# Altium schematic sheet ShieldUart.SchDoc
size A4
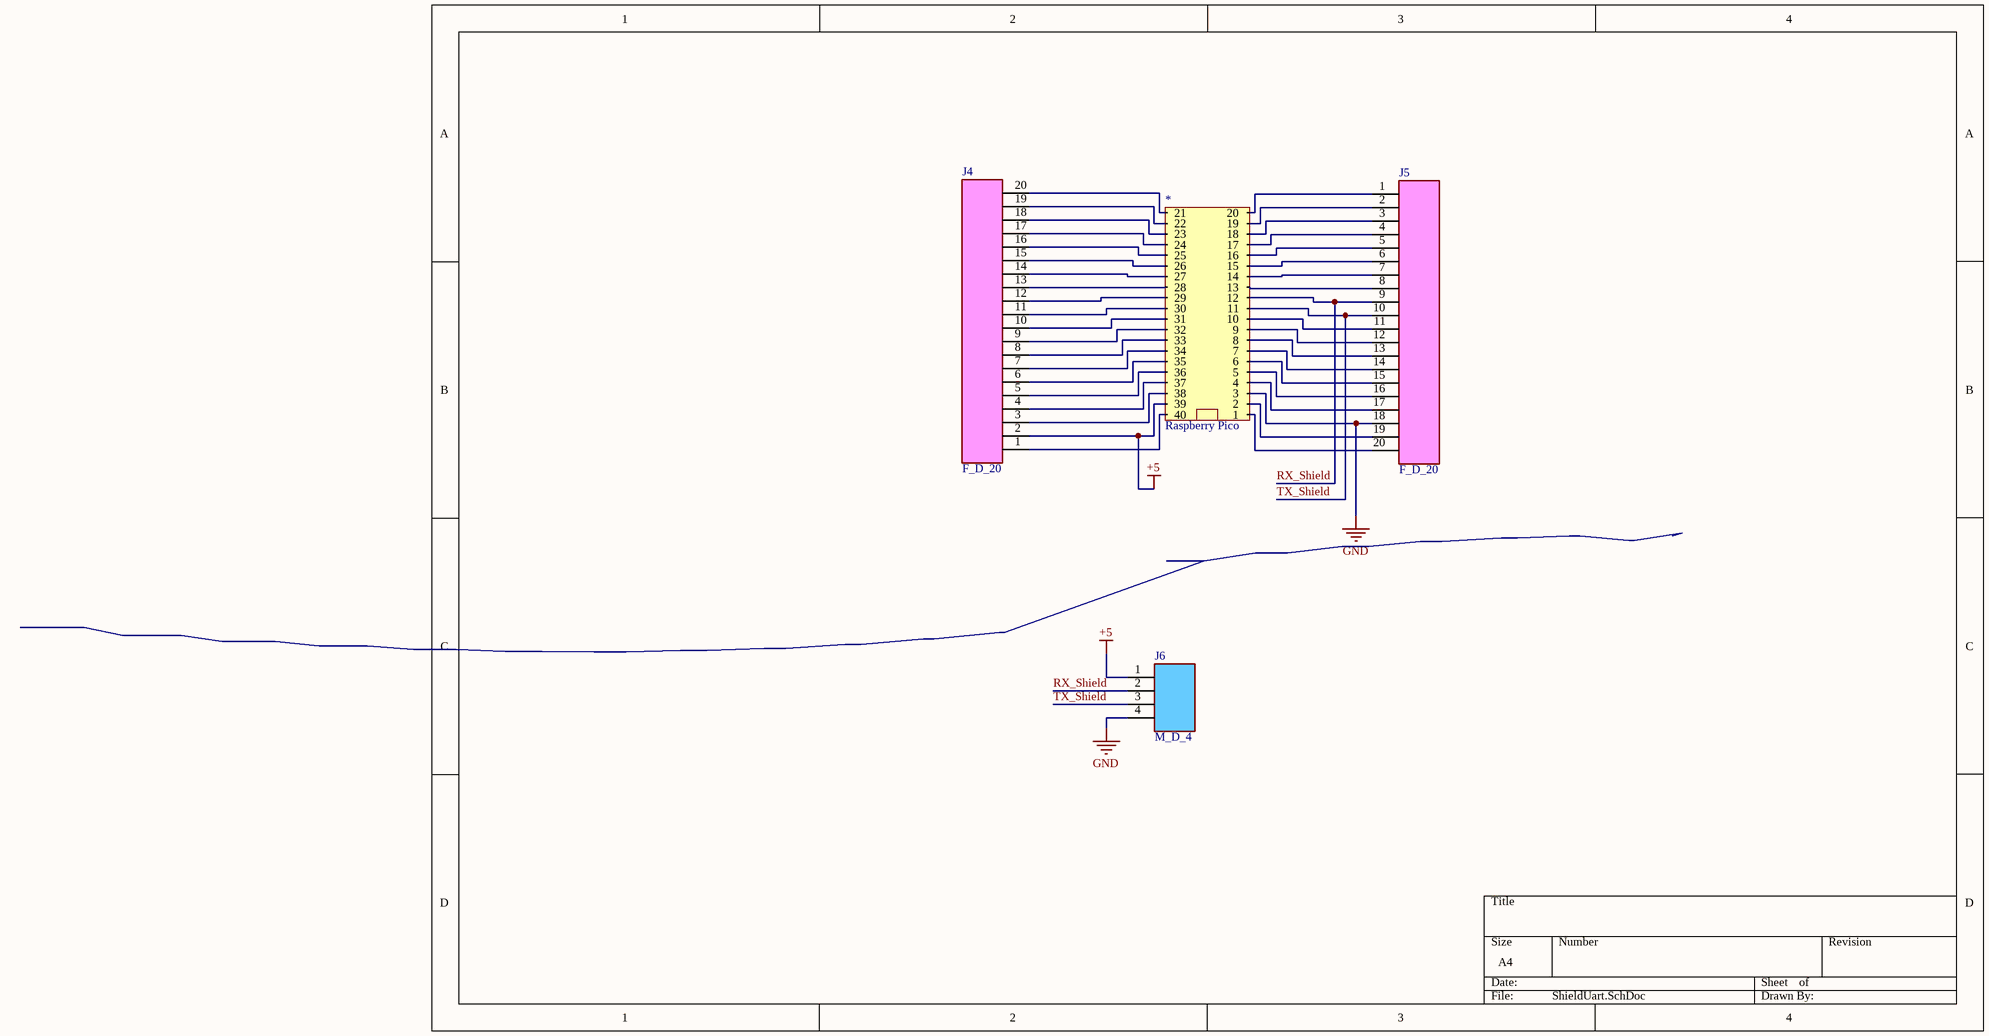
[diagram p0: ShieldUart.SchDoc]

## Parts
*  Raspberry Pico  [Raspberry Pico]
J4  Type: F_D_20  [BARRETTE_20_F_D]  (hidden comment: BARRETTE_20 CONTACTS_1 RANGEE_FEMELLE_DROITE)
J5  Type: F_D_20  [BARRETTE_20_F_D]  (hidden comment: BARRETTE_20 CONTACTS_1 RANGEE_FEMELLE_DROITE)
J6  Type: M_D_4  [BARRETTE_4_M_D]  (hidden comment: BARRETTE_4 CONTACTS_1 RANGEE_MALE_DROITE)

## Nets
+5: *.39 J4.2 J6.1
GND: *.3 J5.18 J6.4
RX_Shield: *.12 J5.9 J6.2
TX_Shield: *.11 J5.10 J6.3
Net*_1: *.1 J5.20
Net*_2: *.2 J5.19
Net*_4: *.4 J5.17
Net*_5: *.5 J5.16
Net*_6: *.6 J5.15
Net*_7: *.7 J5.14
Net*_8: *.8 J5.13
Net*_9: *.9 J5.12
Net*_10: *.10 J5.11
Net*_13: *.13 J5.8
Net*_14: *.14 J5.7
Net*_15: *.15 J5.6
Net*_16: *.16 J5.5
Net*_17: *.17 J5.4
Net*_18: *.18 J5.3
Net*_19: *.19 J5.2
Net*_20: *.20 J5.1
Net*_21: *.21 J4.20
Net*_22: *.22 J4.19
Net*_23: *.23 J4.18
Net*_24: *.24 J4.17
Net*_25: *.25 J4.16
Net*_26: *.26 J4.15
Net*_27: *.27 J4.14
Net*_28: *.28 J4.13
Net*_29: *.29 J4.12
Net*_30: *.30 J4.11
Net*_31: *.31 J4.10
Net*_32: *.32 J4.9
Net*_33: *.33 J4.8
Net*_34: *.34 J4.7
Net*_35: *.35 J4.6
Net*_36: *.36 J4.5
Net*_37: *.37 J4.4
Net*_38: *.38 J4.3
Net*_40: *.40 J4.1

## Library data of the parts
J6 = BARRETTE_4 CONTACTS_1 RANGEE_MALE_DROITE: BARRETTE 4 CONTACTS 1 RANGEE MALE DROITE